# Altium schematic sheet HV_power.SchDoc
size A4; SheetNumber: 5; SheetTotal: 6
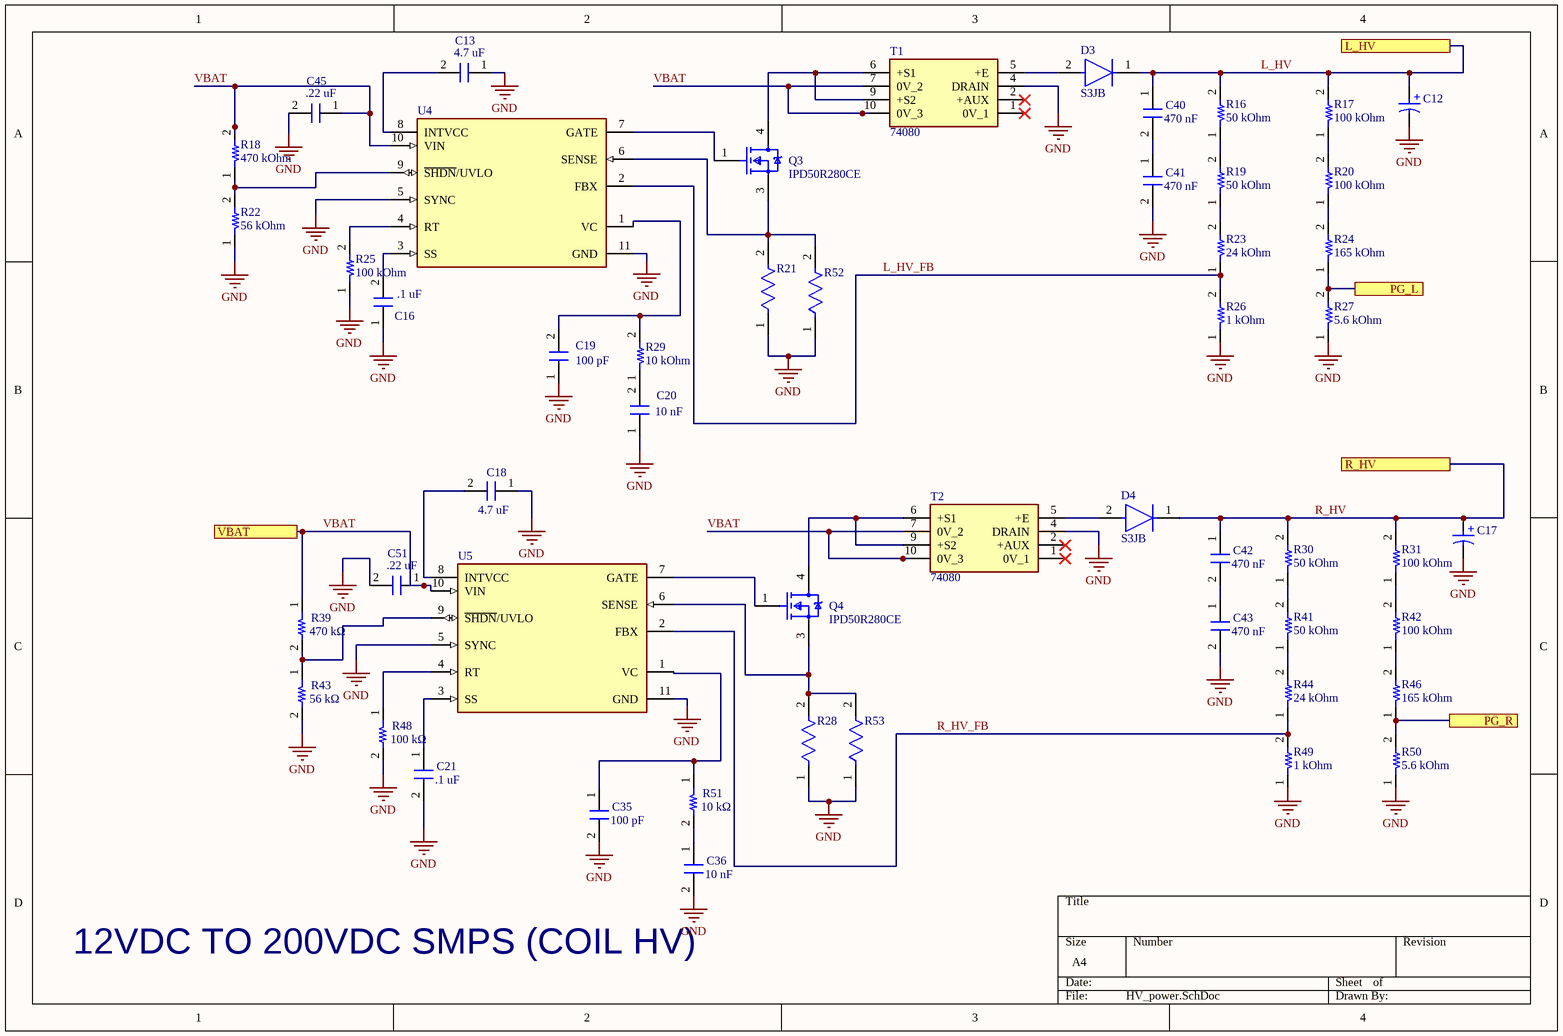
[diagram p0: HV_power.SchDoc]

## Parts
C12  860021373001  [WCAP-ATG5_D6.3H11]  (value not drawn)
C13  value 4.7 uF  [0603_FP]  (hidden comment: GRM21BR61C475KA88L)
C16  value .1 uF  [0603_FP]  (hidden comment: Capacitor_0603)
C17  860021373001  [WCAP-ATG5_D6.3H11]  (value not drawn)
C18  value 4.7 uF  [0603_FP]  (hidden comment: Capacitor_0603)
C19  value 100 pF  [0603_FP]  (hidden comment: Capacitor_0603)
C20  value 10 nF  [0603_FP]  (hidden comment: Capacitor_0603)
C21  value .1 uF  [0603_FP]  (hidden comment: Capacitor_0603)
C35  value 100 pF  [0603_FP]  (hidden comment: Capacitor_0603)
C36  value 10 nF  [0603_FP]  (hidden comment: Capacitor_0603)
C40  value 470 nF  [0603_FP]  (hidden comment: Capacitor_0603)
C41  value 470 nF  [0603_FP]  (hidden comment: Capacitor_0603)
C42  value 470 nF  [0603_FP]  (hidden comment: Capacitor_0603)
C43  value 470 nF  [0603_FP]  (hidden comment: Capacitor_0603)
C45  value .22 uF  [0603_FP]  (hidden comment: GRM21BR61C475KA88L)
C51  value .22 uF  [0603_FP]  (hidden comment: GRM21BR61C475KA88L)
D3  S3JB  [FP-403AF-MFG]
D4  S3JB  [FP-403AF-MFG]
Q3  IPD50R280CE  [FP-PG-TO252-3-MFG]
Q4  IPD50R280CE  [FP-PG-TO252-3-MFG]
R16  value 50 kOhm  [0603_FP]  (hidden comment: Resistor_0603)
R17  value 100 kOhm  [0603_FP]  (hidden comment: Resistor_0603)
R18  value 470 kOhm  [0603_FP]  (hidden comment: Resistor_0603)
R19  value 50 kOhm  [0603_FP]  (hidden comment: Resistor_0603)
R20  value 100 kOhm  [0603_FP]  (hidden comment: Resistor_0603)
R21  CSRN2010FK20L0  [FP-CSRN2010-IPC_B]  (value not drawn)
R22  value 56 kOhm  [0603_FP]  (hidden comment: Resistor_0603)
R23  value 24 kOhm  [0603_FP]  (hidden comment: Resistor_0603)
R24  value 165 kOhm  [0603_FP]  (hidden comment: Resistor_0603)
R25  value 100 kOhm  [0603_FP]  (hidden comment: Resistor_0603)
R26  value 1 kOhm  [0603_FP]  (hidden comment: Resistor_0603)
R27  value 5.6 kOhm  [0603_FP]  (hidden comment: Resistor_0603)
R28  CSRN2010FK20L0  [FP-CSRN2010-IPC_B]  (value not drawn)
R29  value 10 kOhm  [0603_FP]  (hidden comment: Resistor_0603)
R30  value 50 kOhm  [0603_FP]  (hidden comment: Resistor_0603)
R31  value 100 kOhm  [0603_FP]  (hidden comment: Resistor_0603)
R39  value 470 kΩ  [0603_FP]  (hidden comment: Resistor_0603)
R41  value 50 kOhm  [0603_FP]  (hidden comment: Resistor_0603)
R42  value 100 kOhm  [0603_FP]  (hidden comment: Resistor_0603)
R43  value 56 kΩ  [0603_FP]  (hidden comment: Resistor_0603)
R44  value 24 kOhm  [0603_FP]  (hidden comment: Resistor_0603)
R46  value 165 kOhm  [0603_FP]  (hidden comment: Resistor_0603)
R48  value 100 kΩ  [0603_FP]  (hidden comment: Resistor_0603)
R49  value 1 kOhm  [0603_FP]  (hidden comment: Resistor_0603)
R50  value 5.6 kOhm  [0603_FP]  (hidden comment: Resistor_0603)
R51  value 10 kΩ  [0603_FP]  (hidden comment: Resistor_0603)
R52  CSRN2010FK20L0  [FP-CSRN2010-IPC_B]  (value not drawn)
R53  CSRN2010FK20L0  [FP-CSRN2010-IPC_B]  (value not drawn)
T1  74080  [74080]
T2  74080  [74080]
U4  LT3758EDD#PBF  [FP-DD-10-05-08-1699-IPC_B]  (value not drawn)
U5  LT3758EDD#PBF  [FP-DD-10-05-08-1699-IPC_B]  (value not drawn)

## Ports
L_HV (see cd_switching[4B]), PG_L (see logic[3B]), PG_R (see logic[3B]), R_HV (see cd_switching[6B]), VBAT (see input_output[2D], LV_power[1B])

## Nets
GND: C12.2(N) C13.1 C16.1 C17.2(N) C18.1 C19.1 C20.1 C21.2 C35.2 C36.2 C41.2 C43.2 C45.2 C51.2 R21.1 R22.1 R25.1 R26.1 R27.1 R28.1 R43.2 R48.2 R49.1 R50.1 R52.1 R53.1 T1.4(DRAIN) T2.4(DRAIN) U4.5(SYNC) U4.11(GND) U5.5(SYNC) U5.11(GND)
L_HV: C12.1(P) C40.1 D3.1(C) R16.2 R17.2 ; port L_HV
L_HV_FB: R23.1 R26.2 U4.2(FBX)
PG_L: R24.1 R27.2 ; port PG_L
PG_R: R46.1 R50.2 ; port PG_R
R_HV: C17.1(P) C42.1 D4.1(C) R30.2 R31.2 ; port R_HV
R_HV_FB: R44.1 R49.2 U5.2(FBX)
VBAT: C45.1 C51.1 R18.2 R39.1 T1.7(0V_2) T1.10(0V_3) T2.7(0V_2) T2.10(0V_3) U4.10(VIN) U5.10(VIN) ; port VBAT
NetC13_2: C13.2 U4.8(INTVCC)
NetC16_2: C16.2 U4.3(SS)
NetC18_2: C18.2 U5.8(INTVCC)
NetC19_2: C19.2 R29.2 U4.1(VC)
NetC20_2: C20.2 R29.1
NetC21_1: C21.1 U5.3(SS)
NetC35_1: C35.1 R51.1 U5.1(VC)
NetC36_1: C36.1 R51.2
NetC40_2: C40.2 C41.1
NetC42_2: C42.2 C43.1
NetD3_2: D3.2(A) T1.5(+E)
NetD4_2: D4.2(A) T2.5(+E)
NetQ3_1: Q3.1(GATE) U4.7(GATE)
NetQ3_3: Q3.3(SOURCE) R21.2 R52.2 U4.6(SENSE)
NetQ3_4: Q3.4(DRAIN) T1.6(+S1) T1.9(+S2)
NetQ4_1: Q4.1(GATE) U5.7(GATE)
NetQ4_3: Q4.3(SOURCE) R28.2 R53.2 U5.6(SENSE)
NetQ4_4: Q4.4(DRAIN) T2.6(+S1) T2.9(+S2)
NetR16_1: R16.1 R19.2
NetR17_1: R17.1 R20.2
NetR18_1: R18.1 R22.2 U4.9(~{SHDN}/UVLO)
NetR19_1: R19.1 R23.2
NetR20_1: R20.1 R24.2
NetR25_2: R25.2 U4.4(RT)
NetR30_1: R30.1 R41.2
NetR31_1: R31.1 R42.2
NetR39_2: R39.2 R43.1 U5.9(~{SHDN}/UVLO)
NetR41_1: R41.1 R44.2
NetR42_1: R42.1 R46.2
NetR48_1: R48.1 U5.4(RT)

Not connected (* = marked no-connect by the designer): T1 1(0V_1)* 2(+AUX)*; T2 1(0V_1)* 2(+AUX)*

## Notes on the sheet
- 12VDC TO 200VDC SMPS (COIL HV)
- (in symbol CMP-03913-53914267-1) +

## Library data of the parts
C12 C17 = CMP-03913-53914267-1: 860021373001 WCAP-ATG5 Aluminum Electrolytic Capacitors; Life (Hours): 2000hours; Polarity: Polar; Voltage Rating (DC): 400V; Leakage Current: 5.64µA; Tolerance: 20%; Capacitance: 470nF; Pitch: 2.5mm; Ripple Current: 14mA; Height: 11mm; Height - Seated (Max): 12.4968mm; Case/Package: Radial; REACH SVHC: Unknown; Length: 11mm; Diameter: 6.3mm; Lead Pitch: 2.4892mm; Voltage Rating: 400V; Mount: Through Hole; NexarPartId: 53914267; RoHS: Compliant; Min Operating Temperature: -25°C; Packaging: Tape & Box (TB); Max Operating Temperature: 105°C
C13 C16 C18-C21 C35 C36 C40-C43 C45 C51 = Capacitor_0603: Format: 0402; Package: 0402
D3 D4 = CMP-00278-84331306-1: S3JB Rectifier Diode, 1 Phase, 1 Element, 3A, 600V V(RRM), Silicon, DO-214AA; Manufacturer Lifecycle Status: ACTIVE; Element Configuration: Single; Max Junction Temperature (Tj): 150°C; Peak Reverse Current: 10µA; Capacitance: 40pF; Reverse Recovery Time: 1.5µs; Max Forward Surge Current (Ifsm): 80A; Mount: Surface Mount; Max Reverse Voltage (DC): 600V; RoHS: Compliant; Packaging: Cut Tape; Weight: 180mg; Schedule B: 8541100080, 8541100080; Average Rectified Current: 3A; Height: 2.65mm; Min Operating Temperature: -55°C; Reverse Voltage: 600V; Max Repetitive Reverse Voltage (Vrrm): 600V; Lifecycle Status: Production; Case/Package: SMB; Forward Current: 3A; Max Operating Temperature: 150°C; NexarPartId: 84331306
Q3 Q4 = CMP-32901-000143-1: MOSFET N-CH 30V 161A DPAK; Manufacturer Part Number: IRLR7843TRPBF; Manufacturer: Infineon; Drain To Source Resistance: 3.2mΩ; Depletion Mode: False; Reverse Recovery Time: 39ns; Reverse Recovery Charge: 36nC; Threshold Vgs Max: 2.3V; Rthja Max: 50°C/W; Threshold Vgs Min: 1.4V; Power Dissipation: 140W; Pulse Drain Current: 620A; Input Capacitace At Vds: 4380pF @ 15V; Turn On Delay Time: 25ns; Gate To Source Voltage: 20V; Max Forward Diode Voltage: 1V; Gate Charge At Vgs: 34nC @ 4.5V; Max Junction Temp: +175°C; Number Of Channels: 1; Turn Off Delay Time: 34ns; ComponentLink2URL: https://www.infineon.com/dgdl/irlr7843pbf.pdf?fileId=5546d462533600a40153566de53526d8; Temperature Range High: +175°C; Octopart: https://octopart.com/irlr7843trpbf-infineon-65875062; Temperature: -55°C to +175°C; Device Class L3: MOSFETs; Category: Trans; Package: PG-TO252-3; Footprint Url: https://www.infineon.com/cms/en/product/packages/PG-TO252/PG-TO252-3-901/; Continuous Drain Current: 161A; Digikey Description: MOSFET N-CH 30V 161A DPAK; Automotive: No; Lead Free: Yes; Drain To Source Breakdown Voltage: 30V; Height: 2.52mm; Temperature Range Low: -55°C; RoHS: TRUE; Number Of N Channels: 1; Drain To Source Voltage: 30V; ComponentLink2Description: Datasheet; Device Class L2: Transistors; Device Class L1: Discrete Semiconductors
R16-R20 R22-R27 R29-R31 R39 R41-R44 R46 R48-R51 = Resistor_0603: Format: 0402; Package: 0402
R21 R28 R52 R53 = CMP-26527-002648-1: Res Thick Film 2010 20mΩ 1% 1W ±250ppm/°C Molded SMD Plastic T/R; Resistance: 20mR; Number of Terminations: 2; Radiation Hardening: No; Series: CSRN; Length: 0.197inch; RoHS Compliant: Yes; Max Operating Temperature: 155°C; Packaging: Tape and Reel; Resistor Type: Thick Film; Tolerance: 1%; Mount: Surface Mount; Height: 0.03inch; Package Quantity: 1; Case Code (Imperial): 2010; Case Code (Metric): 5025; Max Power Dissipation: 1W; Temperature Coefficient: 250ppm/°C; Case/Package: 2010; Size Code: 2010; Width: 0.097inch; Contact Plating: Tin; Power Rating: 1W; Min Operating Temperature: -55°C; Lead Free: Lead Free
T1 T2 = 74080: Transformer; Manufacturer_Name: MYRRA; Datasheet Link: https://www.tme.com/Document/74b1c6fdfa5c80edd28be424718b4d1b/74080.pdf; Height: 18mm; Manufacturer_Part_Number: 74080
U4 U5 = CMP-09139-000585-1: IC REG CTRLR MULT TOPOLOGY 10DFN; Max Input Voltage: 100V; Number of Outputs: 1; Max Output Voltage: 12V; Max Output Current: 1.2A; Max Frequency: 1MHz; Min Input Voltage: 5.5V; Topology: Boost; Mount: Surface Mount; Min Operating Temperature: -40°C; REACH SVHC: No SVHC; Max Operating Temperature: 125°C; Output Voltage: 100V; Max Supply Voltage: 100V; Switching Frequency: 1MHz; Case/Package: DFN; Package Quantity: 121; Series: -; Packaging: Rail/Tube; RoHS Compliant: Yes; Width: 3mm; Min Supply Voltage: 5.5V; Number of Pins: 10; Length: 3mm; Height: 0.7mm